# Altium schematic sheet KEYBOARD_2020-05-21_13-30-03.schdoc
size 226 x 157 mm
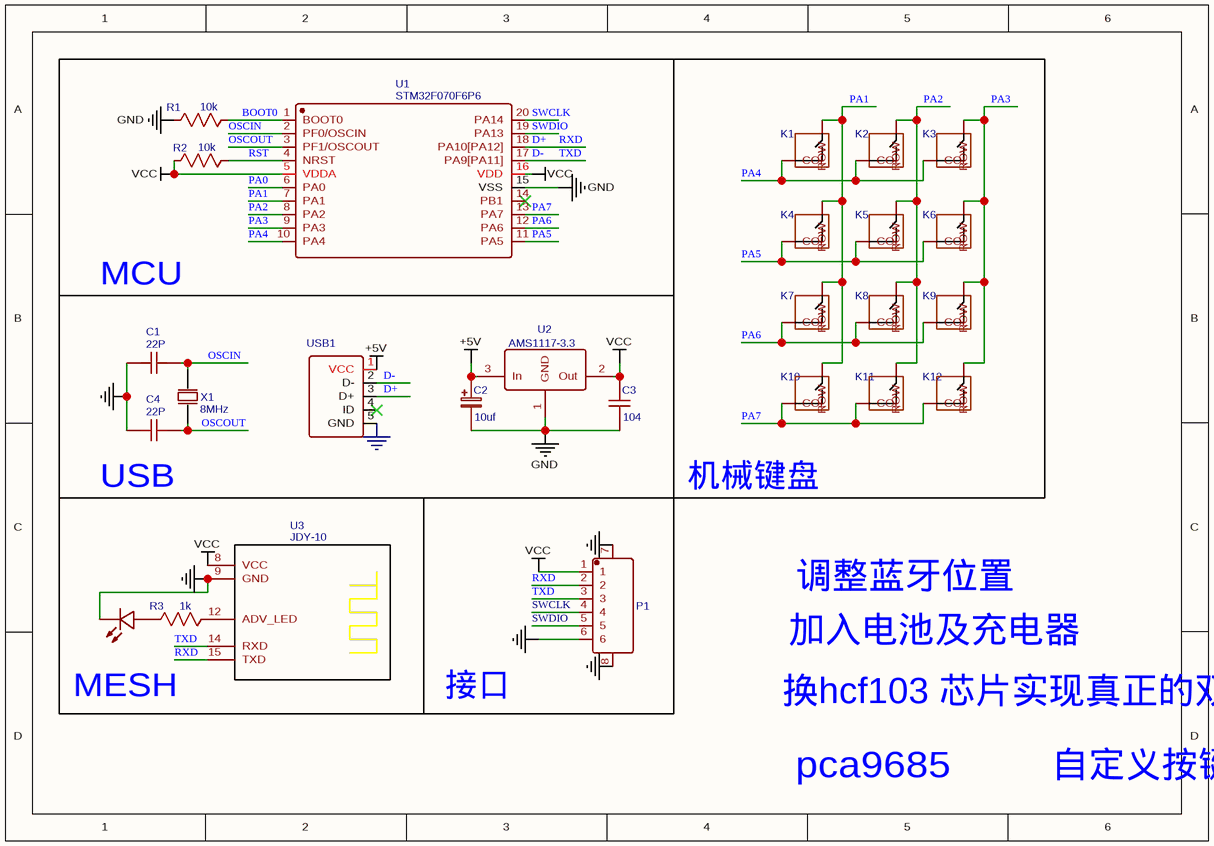
[diagram p0: KEYBOARD_2020-05-21_13-30-03.schdoc]

## Parts
C1  22P  [C0402]
C2  10uf  [C0402]
C3  104  [C0402]
C4  22P  [C0402]
K1  机械键盘轴  [机械键盘轴]  (value not drawn)
K2  机械键盘轴  [机械键盘轴]  (value not drawn)
K3  机械键盘轴  [机械键盘轴]  (value not drawn)
K4  机械键盘轴  [机械键盘轴]  (value not drawn)
K5  机械键盘轴  [机械键盘轴]  (value not drawn)
K6  机械键盘轴  [机械键盘轴]  (value not drawn)
K7  机械键盘轴  [机械键盘轴]  (value not drawn)
K8  机械键盘轴  [机械键盘轴]  (value not drawn)
K9  机械键盘轴  [机械键盘轴]  (value not drawn)
K10  机械键盘轴  [机械键盘轴]  (value not drawn)
K11  机械键盘轴  [机械键盘轴]  (value not drawn)
K12  机械键盘轴  [机械键盘轴]  (value not drawn)
LED1  204-10SURD/S530-A3  [LED0402-RD]  (value not drawn)
P1  FPC 0.5MM 6P Pull type H2.0mm Pick up  [FPC-SMD_AFC07-S06ECC-00]  (value not drawn)
R1  10k  [R0402]
R2  10k  [R0402]
R3  1k  [R0402]
U1  STM32F070F6P6  [SOP-20]
U2  AMS1117-3.3  [SOT-89-3_L4.5-W2.5-P1.50-LS4.2-BR]
U3  JDY-10  [JDY-10]
USB1  Micro USB  [MICRO-USB-12]  (value not drawn)
X1  8MHz  [OSC-SMD_L5.0-W3.2]

## Blocks framed on the sheet
MCU: R1 R2 U1
机械键盘: K1-K12
接口: P1

## Nets
+5V: C2.1 U2.3(In) USB1.1(VCC)
GND: C1.2 C2.2 C3.1 C4.2 LED1.2(K) P1.6 P1.7 P1.8 R1.2 U1.15(VSS) U2.1(GND) U3.9(GND) USB1.5(GND)
VCC: C3.2 P1.1 R2.2 U1.5(VDDA) U1.16(VDD) U2.2(Out) U3.8(VCC)
BOOT0: R1.1 U1.1(BOOT0)
D+: P1.2 U1.18(PA10[PA12]) U3.15(TXD) USB1.3(D+)  [also labelled RXD]
D-: P1.3 U1.17(PA9[PA11]) U3.14(RXD) USB1.2(D-)  [also labelled TXD]
OSCIN: C1.1 U1.2(PF0/OSCIN) X1.2(OSC2)
OSCOUT: C4.1 U1.3(PF1/OSCOUT) X1.1(OSC1)
PA0: U1.6(PA0)
PA1: K1.ROW K4.ROW K7.ROW K10.ROW U1.7(PA1)
PA2: K2.ROW K5.ROW K8.ROW K11.ROW U1.8(PA2)
PA3: K3.ROW K6.ROW K9.ROW K12.ROW U1.9(PA3)
PA4: K1.COL K2.COL K3.COL U1.10(PA4)
PA5: K4.COL K5.COL K6.COL U1.11(PA5)
PA6: K7.COL K8.COL K9.COL U1.12(PA6)
PA7: K10.COL K11.COL K12.COL U1.13(PA7)
RST: R2.1 U1.4(NRST)
SWCLK: P1.4 U1.20(PA14)
SWDIO: P1.5 U1.19(PA13)
NetLED1_1: LED1.1(A) R3.2
NetR3_1: R3.1 U3.12(ADV_LED)

Not connected (* = marked no-connect by the designer): U1 14(PB1)*; USB1 4(ID)*

## Notes on the sheet
- (near C4) USB
- 调整蓝牙位置
- 加入电池及充电器
- MESH
- 换hcf103 芯片实现真正的双模版
- pca9685
- 自定义按键

## Library data of the parts
C1 C4 = 22P: nameAlias: Value(F); spicePre: C; spiceSymbolName: Cap_RAD-0.1_US
C2 = 10uf: nameAlias: Value(F); Contributor: EasyEDA; spicePre: C; spiceSymbolName: Cap_Electrolytic(TH)_D3.0XF1.5_EU
C3 = 104: nameAlias: Value(F); spicePre: C; spiceSymbolName: Cap_RAD-0.1_US
K1-K12 = 机械键盘轴: Contributor: booooy; spicePre: U; spiceSymbolName: 机械键盘轴
LED1 = 204-10SURD/S530-A3: BOM_Manufacturer: EVERLIGHT; BOM_Supplier: LCSC; BOM_Manufacturer Part: 204-10SURD/S530-A3; BOM_Supplier Part: C99772; spicePre: L; spiceSymbolName: 204-10SURD/S530-A3
P1 = FPC 0.5MM 6P Pull type H2.0mm Pick up: BOM_Manufacturer: ReliaPro; spicePre: X; BOM_Supplier: LCSC; BOM_Manufacturer Part: FPC 0.5MM 6P Pull type H2.0mm Pick up; image: //image.lceda.cn/szlcsc/C11083.jpg; BOM_Supplier Part: C11083; spiceSymbolName: FPC 0.5MM 6P Pull type H2.0mm Pick up
R1 R2 = 10k: nameAlias: Value(Ω); spicePre: R; spiceSymbolName: Res_AXIAL-0.3(1/8W)_US
R3 = 1k: nameAlias: Value(Ω); spicePre: R; spiceSymbolName: Res_AXIAL-0.3(1/8W)_US
U1 = STM32F070F6P6: BOM_Manufacturer: STMicroelectronics; BOM_Supplier: LCSC; BOM_Manufacturer Part: STM32F070F6P6; BOM_Supplier Part: C86951; spicePre: U
U2 = AMS1117-3.3: BOM_Manufacturer: AMS; BOM_Manufacturer Part: AMS1117-5.0; sourceId: HltLFyQwq; SMT Type: Basic; Contributor: qianlihaoyue; timeStamp: 1466676067; BOM_Supplier: LCSC; BOM_LCSC Assembly: Yes; image: //image.lceda.cn/szlcsc/C6187.jpg; BOM_Supplier Part: C6187; spicePre: U; spiceSymbolName: AMS1117
U3 = JDY-10: Contributor: qianlihaoyue; spicePre: U; spiceSymbolName: JDY-10
USB1 = Micro USB: BOM_Manufacturer: ValuePro; BOM_Manufacturer Part: Micro USB-B 5P_C40942; BOM_Supplier: LCSC; image: //image.lceda.cn/szlcsc/C40942.jpg; BOM_Supplier Part: C40942; spicePre: U; spiceSymbolName: Micro USB-B 5P_C40942
X1 = 8MHz: BOM_Manufacturer: YXC; BOM_Manufacturer Part: X503224MSB2GI; nameAlias: Frequency; SMT Type: Extend; BOM_Supplier: LCSC; BOM_Supplier Part: C112570; BOM_LCSC Assembly: Yes; spicePre: X; spiceSymbolName: X503224MSB2GI